# Altium project Potentiostat_Sensor.PrjPcb
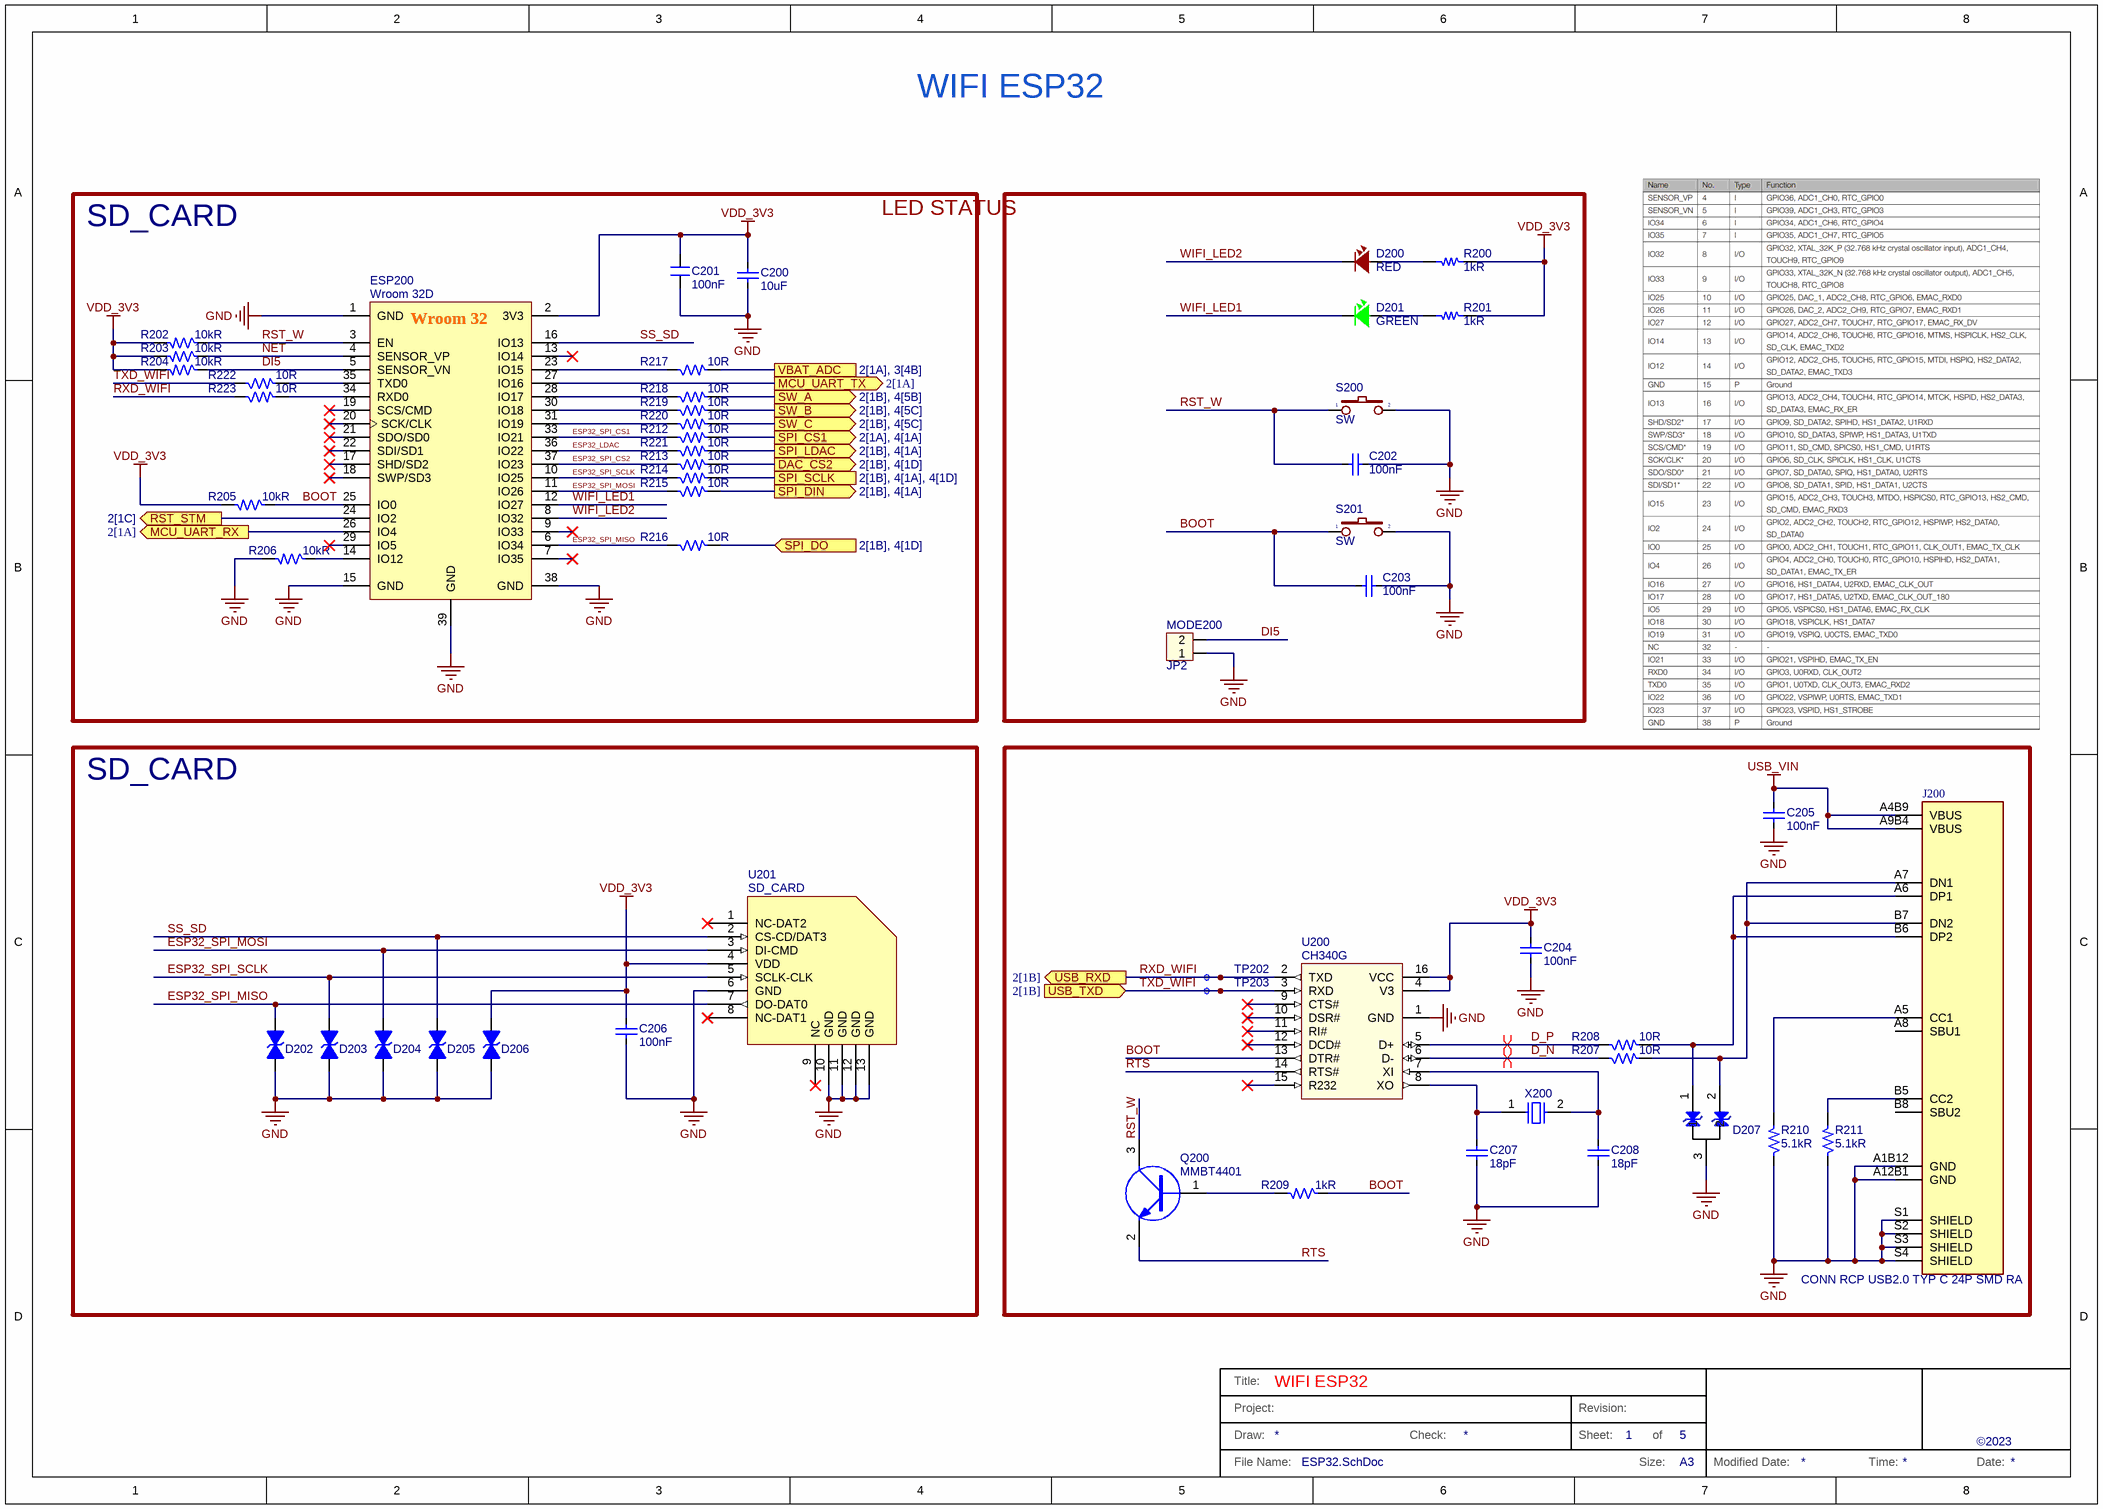
[diagram p0: ESP32.SchDoc]
2 sheets, 92 parts. Net scope: flat (ports and power ports of the same name join across sheets).
Board files: PCB1.PcbDoc, PCB Panel.PcbDoc
Sheets:
  ESP32.SchDoc
  MCU.SchDoc

## Sheet ESP32.SchDoc: WIFI ESP32
size A3; DocumentNumber: 5; SheetNumber: 1; SheetTotal: 5

### Parts
C200  10uF  [C0805]
C201  100nF  [CAP0603-M]
C202  100nF  [CAP0603-M]
C203  100nF  [CAP0603-M]
C204  100nF  [CAP0603-M]
C205  100nF  [CAP0603-M]
C206  100nF  [CAP0603-M]
C207  18pF  [CAP0603-M]
C208  18pF  [CAP0603-M]
D200  RED  [LED-0603-Red]
D201  GREEN  [LED-0603-Green]
D202  ESDAXLC6-1BU2  [2-UDFN]  (value not drawn)
D203  ESDAXLC6-1BU2  [2-UDFN]  (value not drawn)
D204  ESDAXLC6-1BU2  [2-UDFN]  (value not drawn)
D205  ESDAXLC6-1BU2  [2-UDFN]  (value not drawn)
D206  ESDAXLC6-1BU2  [2-UDFN]  (value not drawn)
D207  DESD2CAN2SOQ-7  [SOT23-3]  (value not drawn)
ESP200  Wroom 32D  [ESP32_UE]
J200  CONN RCP USB2.0 TYP C 24P SMD RA  [USB_USB4110-GF-A]
MODE200  JP2  [XH2.54]
Q200  MMBT4401  [SOT23-3]
R200  1kR  [R_0603]
R201  1kR  [R_0603]
R202  10kR  [R_0603]
R203  10kR  [R_0603]
R204  10kR  [R_0603]
R205  10kR  [R_0603]
R206  10kR  [R_0603]
R207  10R  [R_0603]
R208  10R  [R_0603]
R209  1kR  [R_0603]
R210  5.1kR  [R_0603]
R211  5.1kR  [R_0603]
R212  10R  [R_0603]
R213  10R  [R_0603]
R214  10R  [R_0603]
R215  10R  [R_0603]
R216  10R  [R_0603]
R217  10R  [R_0603]
R218  10R  [R_0603]
R219  10R  [R_0603]
R220  10R  [R_0603]
R221  10R  [R_0603]
R222  10R  [R_0603]
R223  10R  [R_0603]
S200  SW  [BUTTON_2P_SMD]
S201  SW  [BUTTON_2P_SMD]
TP202  RXD  [TPH]  (value not drawn)  (no BOM)
TP203  TXD  [TPH]  (value not drawn)  (no BOM)
U200  CH340G  [SOIC-16]
U201  SD_CARD  [MICROSD2]
X200  WTL5G60391VH  [XTAL_SMD_3P5]  (value not drawn)

### Blocks framed on the sheet
SD_CARD: C200 C201 ESP200 R202-R206 R212-R223
LED STATUS: C202 C203 D200 D201 MODE200 R200 R201 S200 S201
SD_CARD: C206 D202-D206 U201

### Ports
DAC_CS2 (out, see 2[1B], 4[1D]), MCU_UART_RX (out, see 2[1A]), MCU_UART_TX (out, see 2[1A]), RST_STM (out, see 2[1C]), SPI_CS1 (out, see 2[1A], 4[1A]), SPI_DIN (out, see 2[1B], 4[1A]), SPI_DO (in, see 2[1B], 4[1D]), SPI_LDAC (out, see 2[1B], 4[1A]), SPI_SCLK (see 2[1B], 4[1A], 4[1D]), SW_A (out, see 2[1B], 4[5B]), SW_B (out, see 2[1B], 4[5C]), SW_C (out, see 2[1B], 4[5C]), USB_RXD (out, see 2[1B]), USB_TXD (in, see 2[1B]), VBAT_ADC (see 2[1A], 3[4B])

### Nets
GND: C200.1 C201.1 C202.1 C203.1 C204.1 C205.1 C206.1 C207.2 C208.2 D202.2(K) D203.2(K) D204.2(K) D205.2(K) D206.2(K) D207.3 ESP200.1(GND) ESP200.15(GND) ESP200.38(GND) ESP200.39(GND) J200.A1B12(GND) J200.A12B1(GND) J200.S1(SHIELD) J200.S2(SHIELD) J200.S3(SHIELD) J200.S4(SHIELD) MODE200.1 R206.2 R210.1 R211.1 S200.2 S201.2 U200.1(GND) U201.6(GND) U201.10(GND) U201.11(GND) U201.12(GND) U201.13(GND)
USB_VIN: C205.2 J200.A4B9(VBUS) J200.A9B4(VBUS)
VDD_3V3: C200.2 C201.2 C204.2 C206.2 D206.1(A) ESP200.2(3V3) R200.2 R201.2 R202.2 R203.2 R204.2 R205.2 U200.4(V3) U200.16(VCC) U201.4(VDD)
BOOT: C203.2 ESP200.25(IO0) R205.1 R209.1 S201.1 U200.13(DTR#)
D_N: R207.1 U200.6(D-)
D_P: R208.1 U200.5(D+)
DI5: ESP200.5(SENSOR_VN) MODE200.2 R204.1
ESP32_LDAC: ESP200.36(IO22) R221.1
ESP32_SPI_CS1: ESP200.33(IO21) R212.1
ESP32_SPI_CS2: ESP200.37(IO23) R213.1
ESP32_SPI_MISO: D202.1(A) ESP200.6(IO34) R216.1 U201.7(DO-DAT0)
ESP32_SPI_MOSI: D204.1(A) ESP200.11(IO26) R215.1 U201.3(DI-CMD)
ESP32_SPI_SCLK: D203.1(A) ESP200.10(IO25) R214.1 U201.5(SCLK-CLK)
NET: ESP200.4(SENSOR_VP) R203.1
RST_STM: ESP200.24(IO2) ; port RST_STM
RST_W: C202.2 ESP200.3(EN) Q200.3(C) R202.1 S200.1
RTS: Q200.2(E) U200.14(RTS#)
RXD_WIFI: R223.1 TP202.1(TP) U200.2(TXD) ; port USB_RXD
SS_SD: D205.1(A) ESP200.16(IO13) U201.2(CS-CD/DAT3)
TXD_WIFI: R222.1 TP203.1(TP) U200.3(RXD) ; port USB_TXD
WIFI_LED1: D201.2 ESP200.12(IO27)
WIFI_LED2: D200.2 ESP200.8(IO32)
NetC207_1: C207.1 U200.8(XO) X200.1
NetC208_1: C208.1 U200.7(XI) X200.2
NetD200_1: D200.1 R200.1
NetD201_1: D201.1 R201.1
NetD207_1: D207.1 J200.A6(DP1) J200.B6(DP2) R208.2
NetD207_2: D207.2 J200.A7(DN1) J200.B7(DN2) R207.2
NetESP200_14: ESP200.14(IO12) R206.1
NetESP200_23: ESP200.23(IO15) R217.1
NetESP200_26: ESP200.26(IO4) ; port MCU_UART_RX
NetESP200_27: ESP200.27(IO16) ; port MCU_UART_TX
NetESP200_28: ESP200.28(IO17) R218.1
NetESP200_30: ESP200.30(IO18) R219.1
NetESP200_31: ESP200.31(IO19) R220.1
NetESP200_34: ESP200.34(RXD0) R223.2
NetESP200_35: ESP200.35(TXD0) R222.2
NetJ200_A5: J200.A5(CC1) R210.2
NetJ200_B5: J200.B5(CC2) R211.2
NetQ200_1: Q200.1(B) R209.2
NetR107_1: R218.2 ; port SW_A
NetR108_1: R219.2 ; port SW_B
NetR109_1: R220.2 ; port SW_C
NetR114_1: R212.2 ; port SPI_CS1
NetR115_1: R214.2 ; port SPI_SCLK
NetR116_1: R216.2 ; port SPI_DO
NetR117_1: R215.2 ; port SPI_DIN
NetR118_1: R217.2 ; port VBAT_ADC
NetR119_1: R213.2 ; port DAC_CS2
NetR120_1: R221.2 ; port SPI_LDAC

Not connected (* = marked no-connect by the designer): ESP200 7(IO35)* 9(IO33)* 13(IO14)* 17(SHD/SD2)* 18(SWP/SD3)* 19(SCS/CMD)* 20(SCK/CLK)* 21(SDO/SD0)* 22(SDI/SD1)* 29(IO5)*; J200 A8(SBU1) B8(SBU2); U200 9(CTS#)* 10(DSR#)* 11(RI#)* 12(DCD#)* 15(R232)*; U201 1(NC-DAT2)* 8(NC-DAT1)* 9(NC)*

### Layout directives
differential pair; differential pair class 90Ohm: D_N, D_P

### Notes on the sheet
- Title:
- Project:
- Draw:
- Check:
- Revision:
- Sheet:
- of
- ©2023
- File Name:
- Size:
- A3
- Modified Date:
- Time:
- Date:
- (in symbol ESP-WROOM-32) Wroom 32

### Library data of the parts
C200 = CapSMD: CAP CER 10UF 16V X5R 0603
C201 = S1200-000091: CAP CER 100nF 16V X5R 0603; Manufacturer: MURATA; Component Kind: Standard; Footprint: C_0603
C202-C206 = CapSMD: CAP CER 100nF 16V X5R 0603
C207 C208 = CapSMD: CAP CER 18PF 50V C0G/NP0 0603
D200 = LED_3: LED RED
D201 = LED_1: LED GREEN
D202-D206 = ESDAXLC6-1BU2: TVS DIODE 3VWM 17VC ST0201; Manufacturer: STMicroelectronics; Capacitance: 0.5pF; Manufacturer Part Number 1: ESDAXLC6-1BU2; Manufacturer 1: STMicroelectronics; Manufacturer Part Number: ESDAXLC6-1BU2
D207 = NUP2105: TVS DIODE 24VWM 41VC SOT23; Manufacturer: onsemi
ESP200 = ESP-WROOM-32
J200 = USB_TypeC_USB4110-GF-A: Conn USB Type C RCP 16 POS 0.3mm/0.5mm Solder ST SMD 16 Terminal 1 Port T/R; Manufacturer 1: Global Connector Technology; Manufacturer Part Number 1: USB4110-GF-A
MODE200 = Con2: Connector 2
Q200 = C1815: NPN 600mW, ECB
R200 R201 = Resistor - SMD: RES SMD 1K OHM 1% 1/8W 0603; Manufacturer: Generic Components
R202-R206 = R: RES SMD 10K OHM 1% 1/8W 0603; Manufacturer: Yageo
R207 R208 R212-R223 = R: RES SMD 10R OHM 1% 1/8W 0603; Manufacturer: Yageo
R209 = R: RES SMD 1K OHM 1% 1/8W 0603; Manufacturer: Yageo
R210 R211 = R: Resistor 1/4W; Manufacturer: Yageo
S200 S201 = SW2: Switch button 2 pin
TP202 TP203 = S1400-000002: Test_Point_1mm; Footprint: TP_1mm
U200 = CH340G: USB to UART Interface; Manufacturer: WCH; Manufacturer Part Number 1: CH340G
U201 = MicroSD: SD/MMC holder; Manufacturer Part Number 1: SD_CARD
X200 = Xtal_2P_SMD_5P0X3P5_8Mhz: XTal 8Mhz; Manufacturer: WTL; Manufacturer Part Number 1: WTL5G60391VH

## Sheet MCU.SchDoc
size A3; SheetNumber: 2; SheetTotal: 5
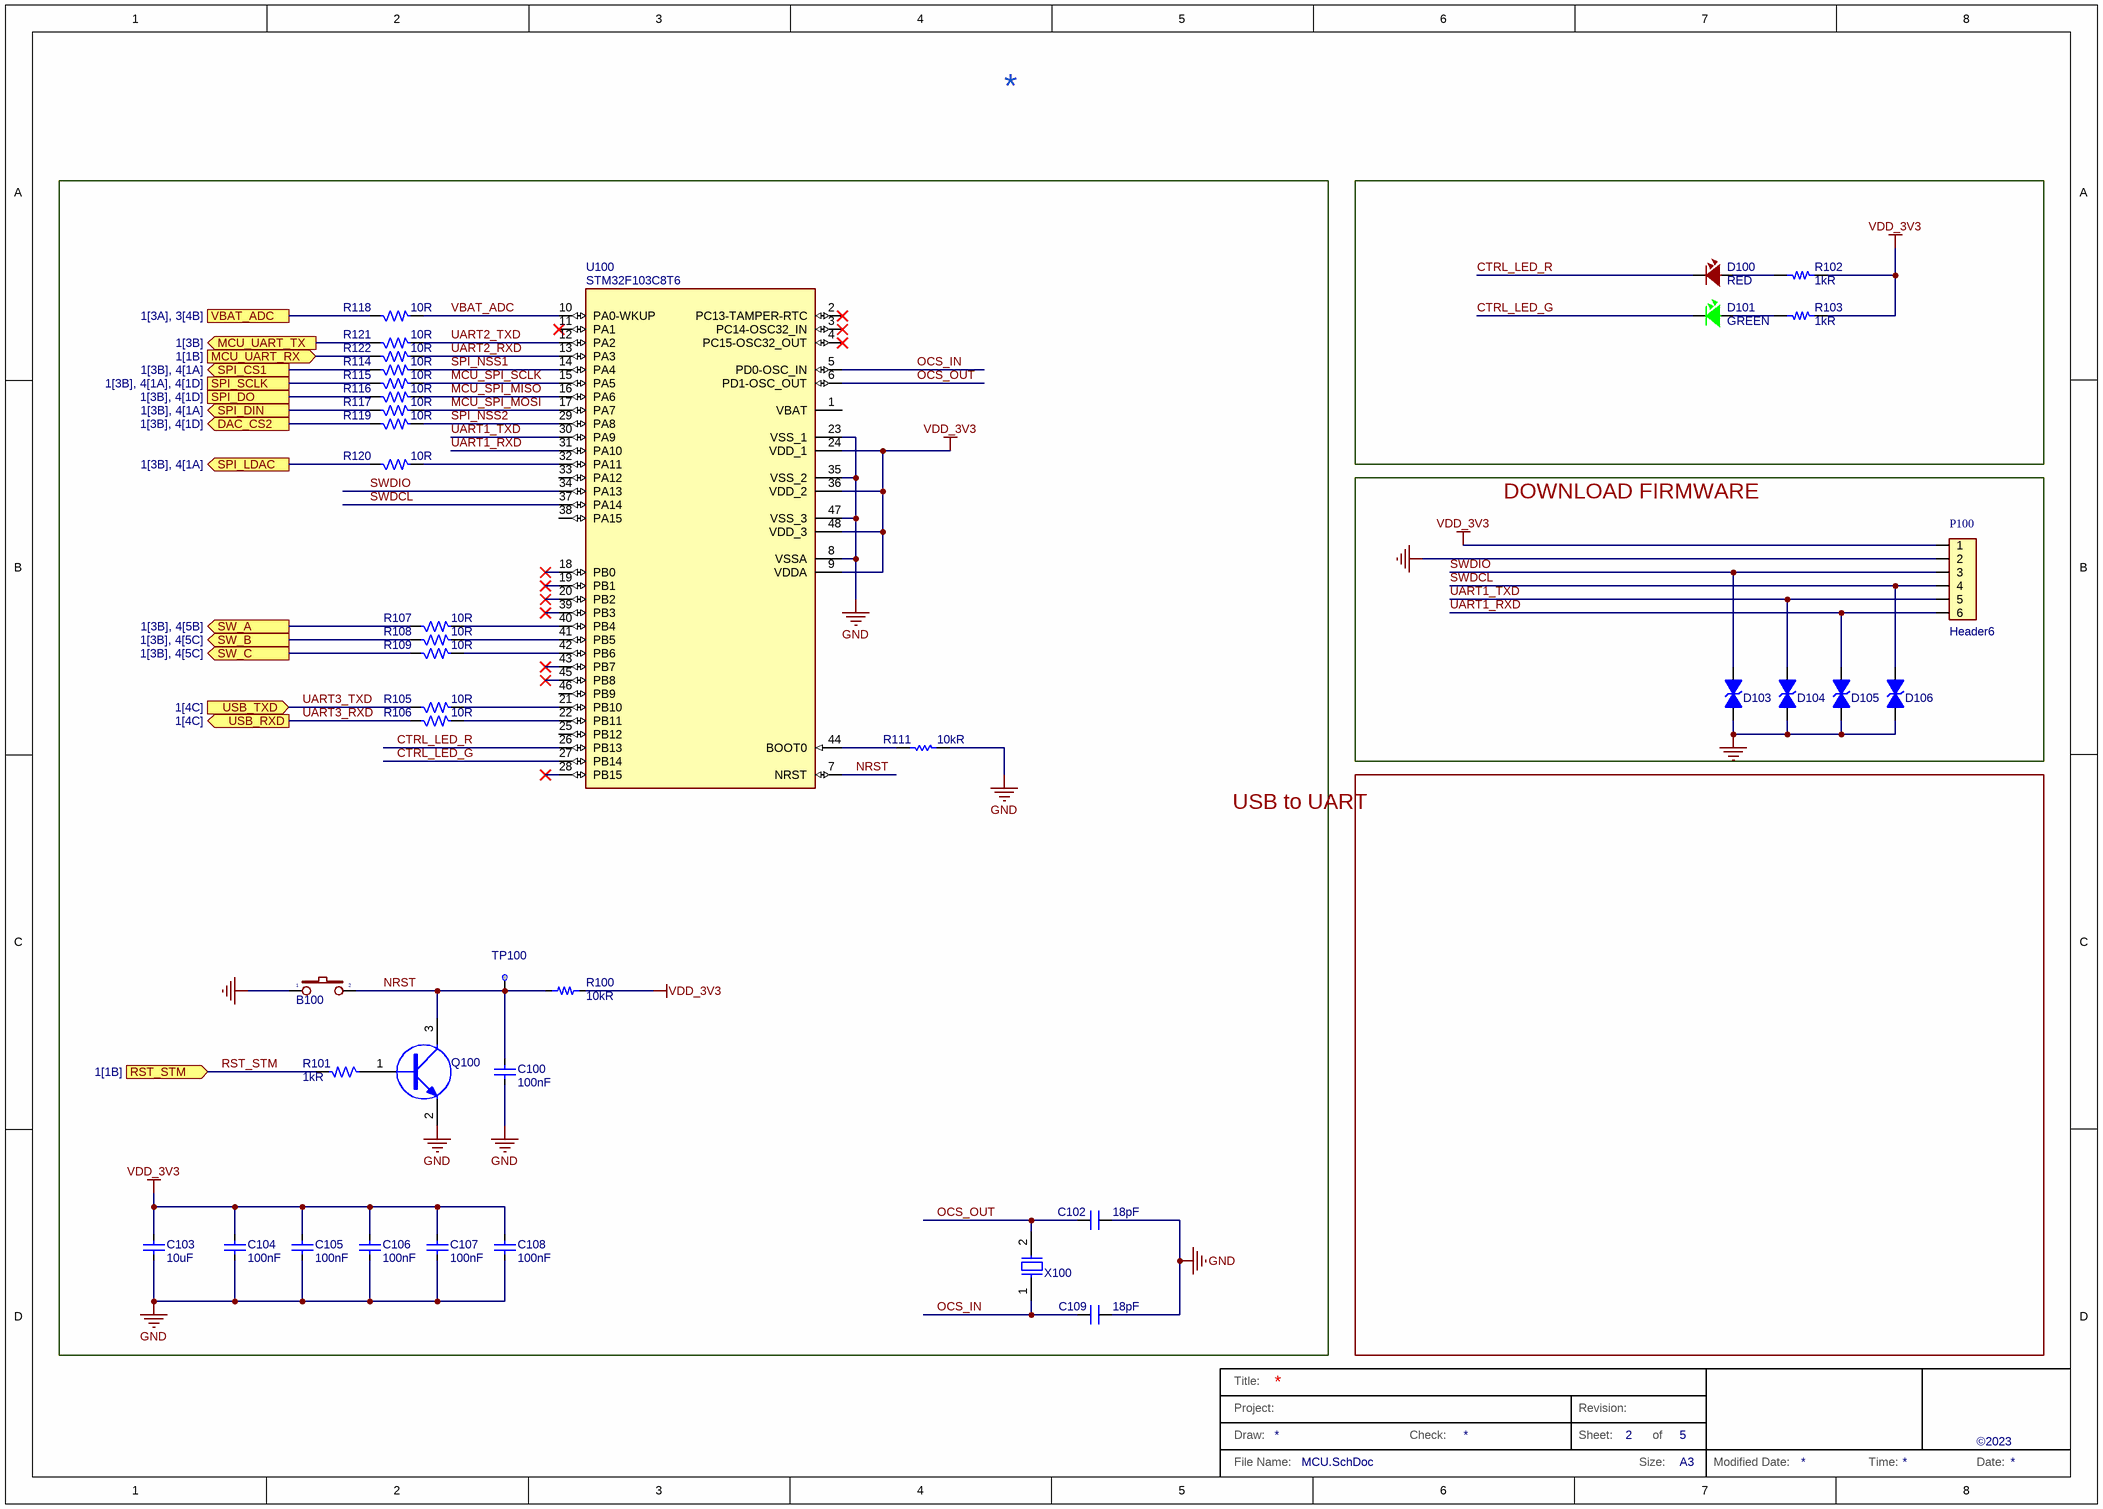
[diagram p1: MCU.SchDoc]

### Parts
B100  Button 3x4x2.5  [BUTTON_2P_SMD]  (value not drawn)
C100  100nF  [CAP0603-M]
C102  18pF  [CAP0603-M]
C103  10uF  [CAP0603-M]
C104  100nF  [CAP0603-M]
C105  100nF  [CAP0603-M]
C106  100nF  [CAP0603-M]
C107  100nF  [CAP0603-M]
C108  100nF  [CAP0603-M]
C109  18pF  [CAP0603-M]
D100  RED  [LED-0603-Red]
D101  GREEN  [LED-0603-Green]
D103  ESDAXLC6-1BU2  [2-UDFN]  (value not drawn)
D104  ESDAXLC6-1BU2  [2-UDFN]  (value not drawn)
D105  ESDAXLC6-1BU2  [2-UDFN]  (value not drawn)
D106  ESDAXLC6-1BU2  [2-UDFN]  (value not drawn)
P100  Header6  [XH2.54 2x3]
Q100  MMBT4401  [SOT23-3]  (value not drawn)
R100  10kR  [R_0603]
R101  1kR  [R_0603]
R102  1kR  [R_0603]
R103  1kR  [R_0603]
R105  10R  [R_0603]
R106  10R  [R_0603]
R107  10R  [R_0603]
R108  10R  [R_0603]
R109  10R  [R_0603]
R111  10kR  [R_0603]
R114  10R  [R_0603]
R115  10R  [R_0603]
R116  10R  [R_0603]
R117  10R  [R_0603]
R118  10R  [R_0603]
R119  10R  [R_0603]
R120  10R  [R_0603]
R121  10R  [R_0603]
R122  10R  [R_0603]
TP100  RST  [TPH]  (value not drawn)  (no BOM)
U100  STM32F103C8T6  [LQFP48]
X100  WTL5G60391VH  [XTAL_SMD_3P5]  (value not drawn)

### Blocks framed on the sheet
DOWNLOAD FIRMWARE: D103-D106 P100

### Ports
DAC_CS2 (out, see 1[3B], 4[1D]), MCU_UART_RX (in, see 1[1B]), MCU_UART_TX (out, see 1[3B]), RST_STM (in, see 1[1B]), SPI_CS1 (out, see 1[3B], 4[1A]), SPI_DIN (out, see 1[3B], 4[1A]), SPI_DO (see 1[3B], 4[1D]), SPI_LDAC (out, see 1[3B], 4[1A]), SPI_SCLK (see 1[3B], 4[1A], 4[1D]), SW_A (out, see 1[3B], 4[5B]), SW_B (out, see 1[3B], 4[5C]), SW_C (out, see 1[3B], 4[5C]), USB_RXD (out, see 1[4C]), USB_TXD (in, see 1[4C]), VBAT_ADC (see 1[3A], 3[4B])

### Nets
GND: B100.1 C100.1 C102.1 C103.1 C104.1 C105.1 C106.1 C107.1 C108.1 C109.1 D103.2(K) D104.2(K) D105.2(K) D106.2(K) P100.2 Q100.2(E) R111.2 U100.8(VSSA) U100.23(VSS_1) U100.35(VSS_2) U100.47(VSS_3)
VDD_3V3: C103.2 C104.2 C105.2 C106.2 C107.2 C108.2 P100.1 R100.1 R102.2 R103.2 U100.9(VDDA) U100.24(VDD_1) U100.36(VDD_2) U100.48(VDD_3)
CTRL_LED_G: D101.2 U100.27(PB14)
CTRL_LED_R: D100.2 U100.26(PB13)
MCU_SPI_MISO: R116.2 U100.16(PA6)
MCU_SPI_MOSI: R117.2 U100.17(PA7)
MCU_SPI_SCLK: R115.2 U100.15(PA5)
NRST: B100.2 C100.2 Q100.3(C) R100.2 TP100.1(TP) U100.7(NRST)
OCS_IN: C109.2 U100.5(PD0-OSC_IN) X100.1
OCS_OUT: C102.2 U100.6(PD1-OSC_OUT) X100.2
RST_STM: R101.2 ; port RST_STM
SPI_NSS1: R114.2 U100.14(PA4)
SPI_NSS2: R119.2 U100.29(PA8)
SWDCL: D106.1(A) P100.4 U100.37(PA14)
SWDIO: D103.1(A) P100.3 U100.34(PA13)
UART1_RXD: D105.1(A) P100.6 U100.31(PA10)
UART1_TXD: D104.1(A) P100.5 U100.30(PA9)
UART2_RXD: R122.2 U100.13(PA3)
UART2_TXD: R121.2 U100.12(PA2)
UART3_RXD: R106.1 ; port USB_RXD  [project net RXD_WIFI]
UART3_TXD: R105.1 ; port USB_TXD  [project net TXD_WIFI]
VBAT_ADC: R118.2 U100.10(PA0-WKUP)
NetD100_1: D100.1 R102.1
NetD101_1: D101.1 R103.1
NetESP200_26: R122.1 ; port MCU_UART_RX
NetESP200_27: R121.1 ; port MCU_UART_TX
NetQ100_1: Q100.1(B) R101.1
NetR105_2: R105.2 U100.21(PB10)
NetR106_2: R106.2 U100.22(PB11)
NetR107_1: R107.1 ; port SW_A
NetR107_2: R107.2 U100.40(PB4)
NetR108_1: R108.1 ; port SW_B
NetR108_2: R108.2 U100.41(PB5)
NetR109_1: R109.1 ; port SW_C
NetR109_2: R109.2 U100.42(PB6)
NetR111_1: R111.1 U100.44(BOOT0)
NetR114_1: R114.1 ; port SPI_CS1
NetR115_1: R115.1 ; port SPI_SCLK
NetR116_1: R116.1 ; port SPI_DO
NetR117_1: R117.1 ; port SPI_DIN
NetR118_1: R118.1 ; port VBAT_ADC
NetR119_1: R119.1 ; port DAC_CS2
NetR120_1: R120.1 ; port SPI_LDAC
NetR120_2: R120.2 U100.32(PA11)

Not connected (* = marked no-connect by the designer): U100 1(VBAT) 2(PC13-TAMPER-RTC)* 3(PC14-OSC32_IN)* 4(PC15-OSC32_OUT)* 11(PA1)* 18(PB0)* 19(PB1)* 20(PB2)* 25(PB12) 28(PB15)* 33(PA12) 38(PA15) 39(PB3)* 43(PB7)* 45(PB8)* 46(PB9)

### Notes on the sheet
- USB to UART
- Title:
- Project:
- Draw:
- Check:
- Revision:
- Sheet:
- of
- ©2023
- File Name:
- Size:
- A3
- Modified Date:
- Time:
- Date:

### Library data of the parts
C100 C104-C108 = CapSMD: CAP CER 100nF 16V X5R 0603
C102 C109 = Cap_Cer_0603_18pF: CAP CER 18PF 50V C0G/NP0 0603; Manufacturer: Murata Electronics
C103 = CapSMD: CAP CER 10UF 16V X5R 0603
D100 = LED_3: LED RED
D101 = LED_1: LED GREEN
D103-D106 = ESDAXLC6-1BU2: as D202 on sheet ESP32; Manufacturer Part Number 1: ESDAXLC6-1BU2; Manufacturer 1: STMicroelectronics; Manufacturer Part Number: ESDAXLC6-1BU2
P100 = Header6: Manufacturer: W¨¹rth Elektronik eiSos GmbH
Q100 = NPN: Transistor C1815, SOT23; Manufacturer: Fairchild Semiconductor
R100 = Resistor - SMD: RES SMD 10K OHM 1% 1/8W 0603; Manufacturer: Generic Components
R101 = R: as R209 on sheet ESP32
R102 R103 = Resistor - SMD: as R200 on sheet ESP32
R105-R109 R114-R122 = R: as R207 on sheet ESP32
R111 = RES_10K_0201: RES SMD 10K OHM 1% 1/8W 0603; Manufacturer 1: Yageo; Manufacturer Part Number 1: RC0201FR-0711K3L; Revision: 1; Manufacturer 2: Panasonic Electronic Components
TP100 = S1400-000002: Test_Point_1mm; Footprint: TP_1mm
U100 = STM32F103C8T6: IC MCU 48LQFP; Manufacturer: STMicroelectronics; Manufacturer Part Number 1: STM32F103C8T6
X100 = Xtal_2P_SMD_5P0X3P5_8Mhz: XTal 8Mhz; Manufacturer: WTL; Manufacturer Part Number 1: WTL5G60391VH

## Nets that join several sheets
GND: ESP32 (37 pins), MCU (21 pins)
VDD_3V3: ESP32 (15 pins), MCU (14 pins)
NetESP200_26: ESP32 (ESP200.26), MCU (R122.1)
NetESP200_27: ESP32 (ESP200.27), MCU (R121.1)
NetR107_1: ESP32 (R218.2), MCU (R107.1)
NetR108_1: ESP32 (R219.2), MCU (R108.1)
NetR109_1: ESP32 (R220.2), MCU (R109.1)
NetR114_1: ESP32 (R212.2), MCU (R114.1)
NetR115_1: ESP32 (R214.2), MCU (R115.1)
NetR116_1: ESP32 (R216.2), MCU (R116.1)
NetR117_1: ESP32 (R215.2), MCU (R117.1)
NetR118_1: ESP32 (R217.2), MCU (R118.1)
NetR119_1: ESP32 (R213.2), MCU (R119.1)
NetR120_1: ESP32 (R221.2), MCU (R120.1)
RST_STM: ESP32 (ESP200.24), MCU (R101.2)
RXD_WIFI: ESP32 (R223.1 TP202.1 U200.2), MCU (R106.1)
TXD_WIFI: ESP32 (R222.1 TP203.1 U200.3), MCU (R105.1)

## Assembly variants
Potentiostat_Sensor_V1: all parts fitted